# EAGLE design Universaldimmer (EAGLE 5.09)
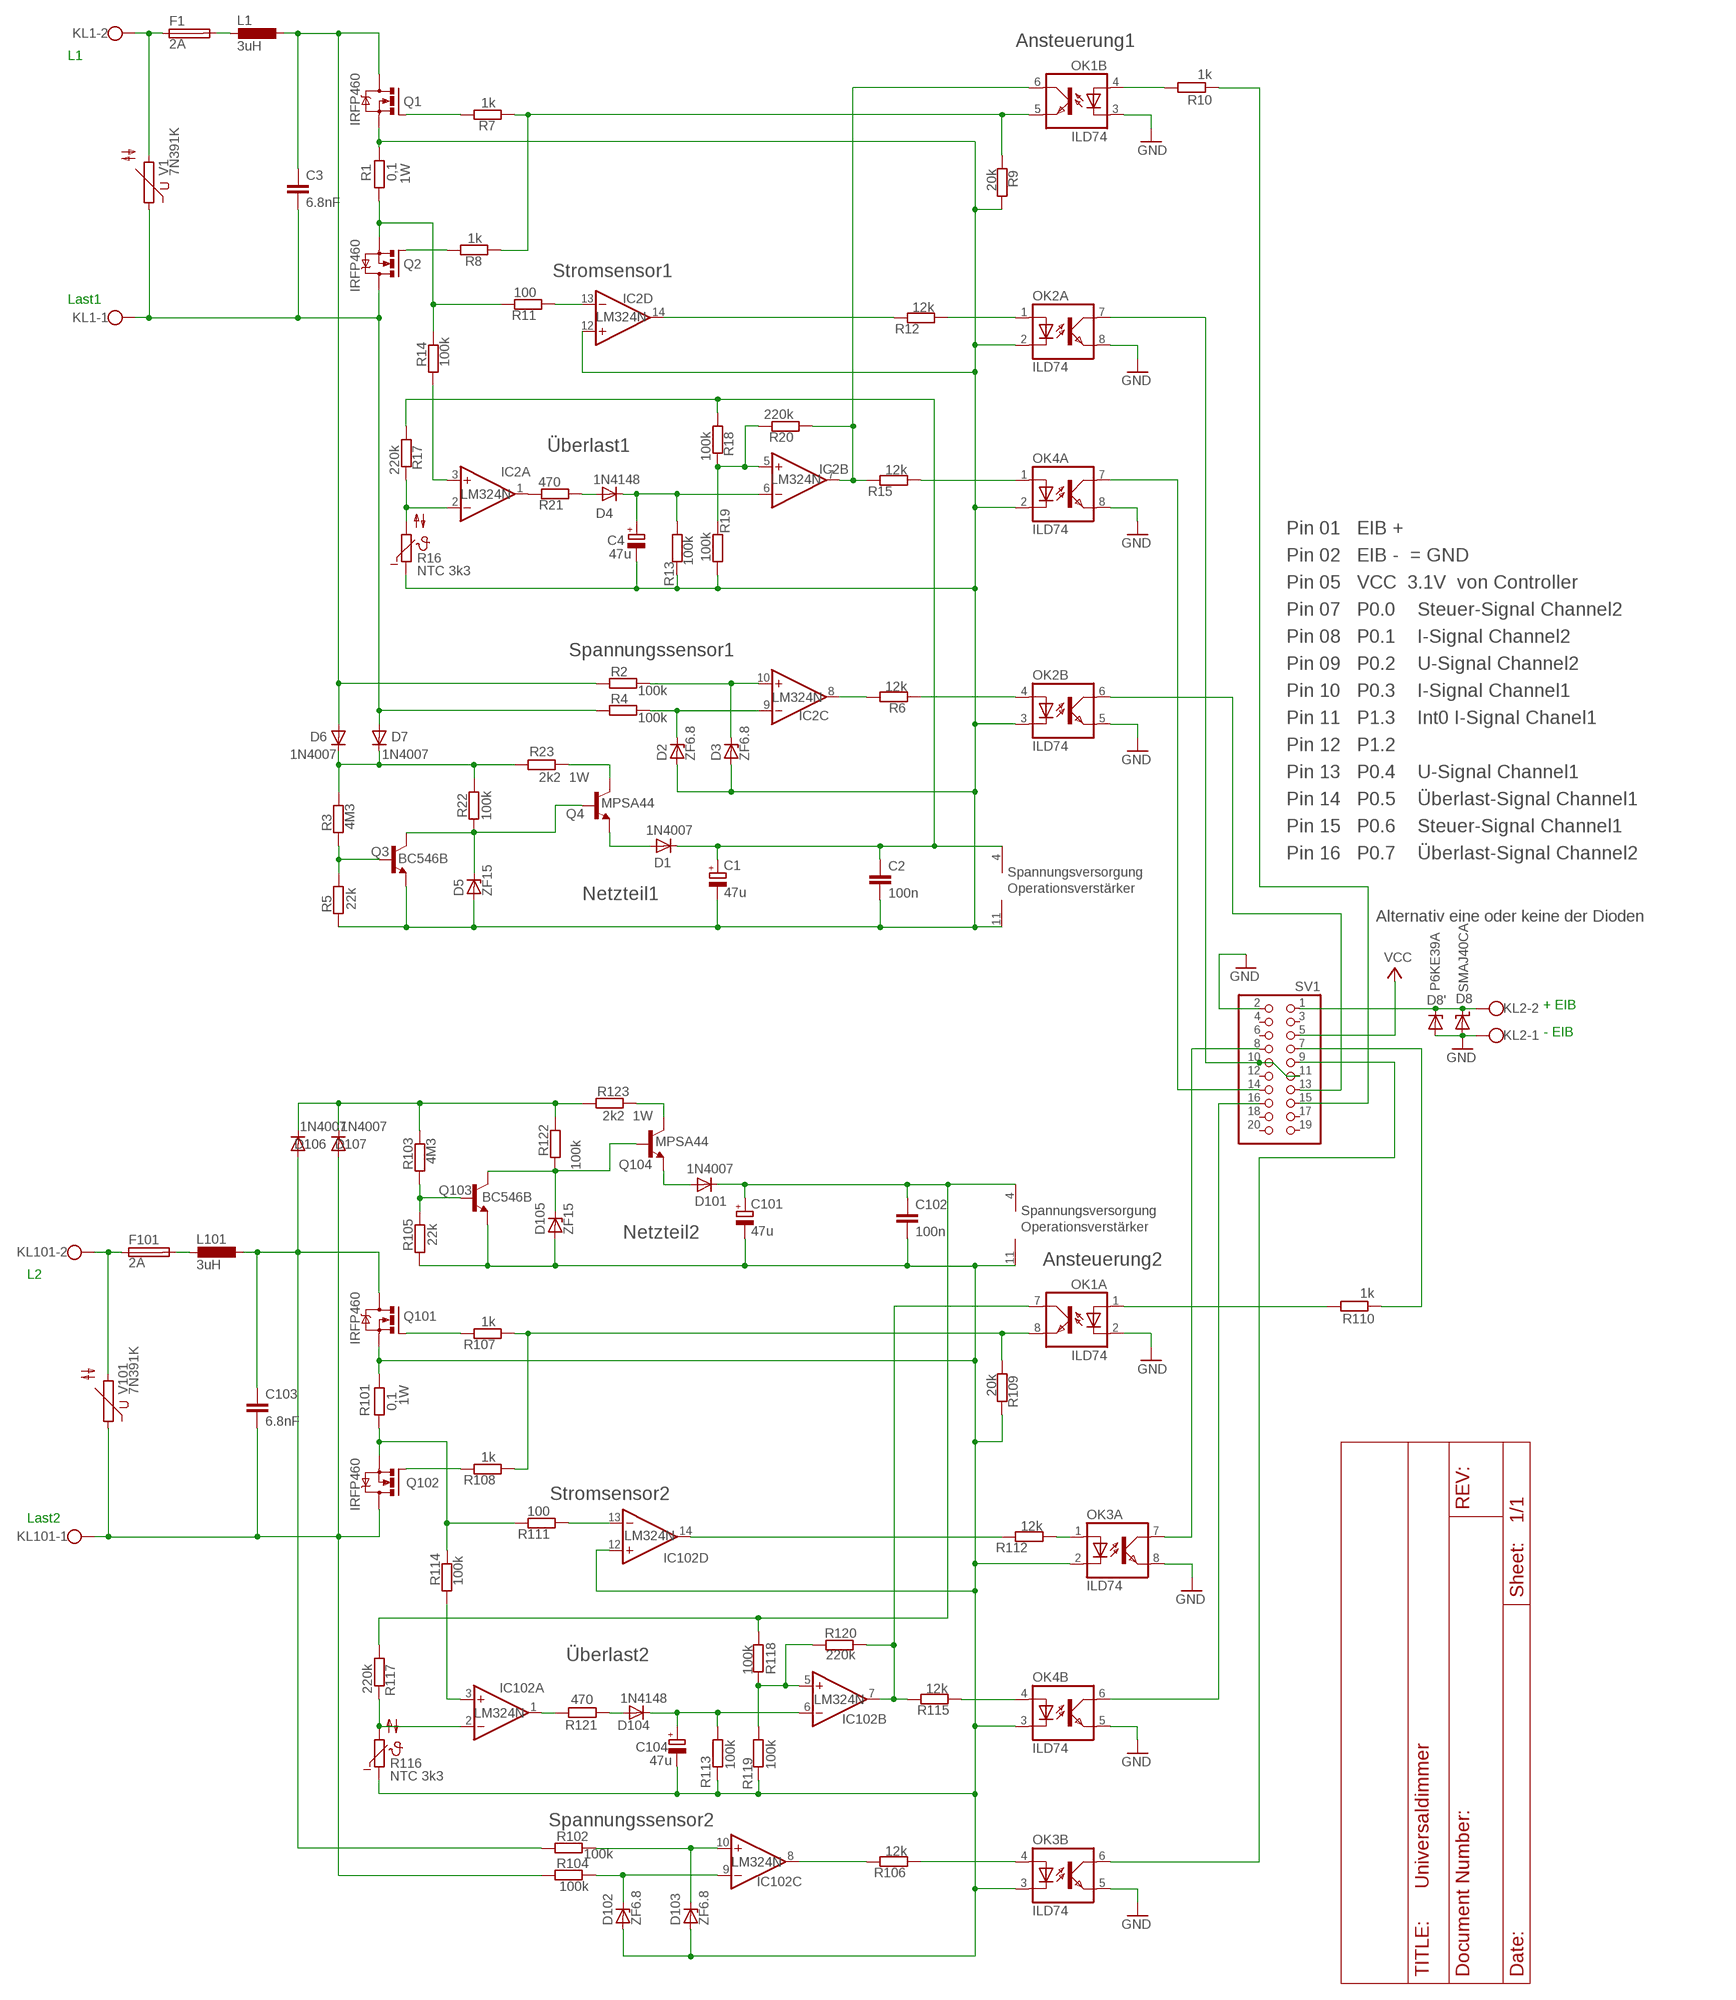
[diagram p0: schematic, sheet 1]

## Parts
C1  47u  CPOL-EUE2-5  [E2-5]
C2  100n  C-EU025-030X050  [C025-030X050]
C3  6.8nF  C-EU050-075X075  [C050-075X075]
C4  47u  CPOL-EUE2-5  [E2-5]
C101  47u  CPOL-EUE2-5  [E2-5]
C102  100n  C-EU025-030X050  [C025-030X050]
C103  6.8nF  C-EU050-075X075  [C050-075X075]
C104  47u  CPOL-EUE2-5  [E2-5]
D1  1N4007  1N4148DO35-7S  [D-7]
D2  ZF6.8  ZENER-DIODEZD-5  [ZDIO-5]
D3  ZF6.8  ZENER-DIODEZD-7.5  [ZDIO-7.5]
D4  1N4148  1N4148DO35-7S  [D-7]
D5  ZF15  ZENER-DIODEZD-7.5  [ZDIO-7.5]
D6  1N4007  DIODE-D-7.5  [D-7.5]
D7  1N4007  DIODE-D-7.5  [D-7.5]
D8  SMAJ40CA  SUPPRESSOR-SMBJ  [SMBJ]
D8'  P6KE39A  ZENER-DIODEZD-7.5  [ZDIO-7.5]
D101  1N4007  1N4148DO35-7S  [D-7]
D102  ZF6.8  ZENER-DIODEZD-5  [ZDIO-5]
D103  ZF6.8  ZENER-DIODEZD-7.5  [ZDIO-7.5]
D104  1N4148  1N4148DO35-7S  [D-7]
D105  ZF15  ZENER-DIODEZD-7.5  [ZDIO-7.5]
D106  1N4007  DIODE-D-7.5  [D-7.5]
D107  1N4007  DIODE-D-7.5  [D-7.5]
F1  2A  TR5  [TR5]
F101  2A  TR5  [TR5]
IC2  LM324N  [DIL14]
IC102  LM324N  [DIL14]
KL1  W237-102  [W237-102]
KL2  W237-102  [W237-102]
KL101  W237-102  [W237-102]
L1  3uH  L-EU414V  [0414V]
L101  3uH  L-EU414V  [0414V]
OK1  ILD74  ILD2  [DIL08]
OK2  ILD74  ILD2  [DIL08]
OK3  ILD74  ILD2  [DIL08]
OK4  ILD74  ILD2  [DIL08]
Q1  IRFP460  IRFPC40  [TO247BV]
Q2  IRFP460  IRFPC40  [TO247BV]
Q3  BC546B  [TO92-EBC]
Q4  MPSA44  MPSA44-NPN-TO92-EBC  [TO92-EBC]
Q101  IRFP460  IRFPC40  [TO247BV]
Q102  IRFP460  IRFPC40  [TO247BV]
Q103  BC546B  [TO92-EBC]
Q104  MPSA44  MPSA44-NPN-TO92-EBC  [TO92-EBC]
R1  0,1  R-EU_0414/5V  [0414V]
R2  100k  R-EU_0204/7  [0204/7]
R3  4M3  R-EU_0204/7  [0204/7]
R4  100k  R-EU_0204/7  [0204/7]
R5  22k  R-EU_0204/7  [0204/7]
R6  12k  R-EU_0204/7  [0204/7]
R7  1k  R-EU_0204/7  [0204/7]
R8  1k  R-EU_0204/7  [0204/7]
R9  20k  R-EU_0204/7  [0204/7]
R10  1k  R-EU_0204/7  [0204/7]
R11  100  R-EU_0204/7  [0204/7]
R12  12k  R-EU_0204/7  [0204/7]
R13  100k  R-EU_0204/7  [0204/7]
R14  100k  R-EU_0204/7  [0204/7]
R15  12k  R-EU_0204/7  [0204/7]
R16  NTC 3k3  NTC640  [P640]
R17  220k  R-EU_0204/7  [0204/7]
R18  100k  R-EU_0204/7  [0204/7]
R19  100k  R-EU_0204/7  [0204/7]
R20  220k  R-EU_0204/7  [0204/7]
R21  470  R-EU_0204/7  [0204/7]
R22  100k  R-EU_0204/7  [0204/7]
R23  2k2 1W  R-EU_0207/15  [0207/15]
R101  0,1  R-EU_0414/5V  [0414V]
R102  100k  R-EU_0204/7  [0204/7]
R103  4M3  R-EU_0204/7  [0204/7]
R104  100k  R-EU_0204/7  [0204/7]
R105  22k  R-EU_0204/7  [0204/7]
R106  12k  R-EU_0204/7  [0204/7]
R107  1k  R-EU_0204/7  [0204/7]
R108  1k  R-EU_0204/7  [0204/7]
R109  20k  R-EU_0204/7  [0204/7]
R110  1k  R-EU_0204/7  [0204/7]
R111  100  R-EU_0204/7  [0204/7]
R112  12k  R-EU_0207/15  [0207/15]
R113  100k  R-EU_0204/7  [0204/7]
R114  100k  R-EU_0204/7  [0204/7]
R115  12k  R-EU_0204/7  [0204/7]
R116  NTC 3k3  NTC640  [P640]
R117  220k  R-EU_0204/7  [0204/7]
R118  100k  R-EU_0204/7  [0204/7]
R119  100k  R-EU_0204/7  [0204/7]
R120  220k  R-EU_0204/7  [0204/7]
R121  470  R-EU_0204/7  [0204/7]
R122  100k  R-EU_0204/7  [0204/7]
R123  2k2 1W  R-EU_0207/15  [0207/15]
SV1  PINHD-2X10  [2X10]
V1  7N391K  S05K11  [S05K11]
V101  7N391K  S05K11  [S05K11]

## Nets
AGND1: C1.- C2.2 C4.- D2.A D3.A D5.A IC2.11(P:V-) IC2.12(D:+IN) OK2.2(A:C) OK2.3(B:C) OK4.2(A:C) Q1.S Q3.E R1.2 R5.1 R9.2 R13.2 R16.1 R19.1
AGND2: C101.- C102.2 C104.- D102.A D103.A D105.A IC102.11(P:V-) IC102.12(D:+IN) OK3.2(A:C) OK3.3(B:C) OK4.3(B:C) Q101.S Q103.E R101.2 R105.1 R109.2 R113.2 R116.1 R119.2
GND: D8'.A D8.A KL2.1 OK1.2(A:C) OK1.3(B:C) OK2.5(B:EMIT) OK2.8(A:EMIT) OK3.5(B:EMIT) OK3.8(A:EMIT) OK4.5(B:EMIT) OK4.8(A:EMIT) SV1.2
N$1: R10.1 SV1.15
N$2: OK1.4(B:A) R10.2
N$3: C3.1 D6.A L1.1 Q1.D R2.1
N$4: Q2.S R1.1 R11.2 R14.2
N$5: OK2.6(B:COL) SV1.13
N$6: IC2.7(B:OUT) OK1.6(B:COL) R15.2 R20.1
N$7: OK2.7(A:COL) SV1.10 SV1.11
N$8: F1.1 KL1.2 V1.2
N$9: Q2.G R8.2
N$10: OK1.1(A:A) R110.2
N$11: IC2.3(A:+IN) R14.1
N$12: D6.C D7.C R3.2 R22.2 R23.1
N$13: OK2.4(B:A) R6.1
N$14: IC102.7(B:OUT) OK1.7(A:COL) R115.2 R120.2
N$15: IC2.8(C:OUT) R6.2
N$16: Q3.B R3.1 R5.2
N$17: Q1.G R7.2
N$18: C3.2 D7.A KL1.1 Q2.D R4.1 V1.1
N$20: D8'.C D8.C KL2.2 SV1.1
N$21: IC2.2(A:-IN) R16.2 R17.2
N$22: F1.2 L1.2
N$23: D3.C IC2.10(C:+IN) R2.2
N$24: D2.C IC2.9(C:-IN) R4.2
N$25: IC2.1(A:OUT) R21.2
N$26: C103.2 D107.A KL101.1 Q102.D R104.1 V101.1
N$27: OK3.1(A:A) R112.1
N$28: OK2.1(A:A) R12.1
N$30: C4.+ D4.C IC2.6(B:-IN) R13.1
N$31: D5.C Q3.C Q4.B R22.1
N$32: OK4.1(A:A) R15.1
N$33: OK4.7(A:COL) SV1.14
N$34: IC2.5(B:+IN) R18.2 R19.2 R20.2
N$35: Q4.C R23.2
N$36: OK1.8(A:EMIT) R107.1 R108.1 R109.1
N$38: Q102.S R101.1 R111.2 R114.2
N$40: Q102.G R108.2
N$42: D106.C D107.C R103.2 R122.2 R123.1
N$43: D103.C IC102.10(C:+IN) R102.2
N$44: D102.C IC102.9(C:-IN) R104.2
N$45: OK3.4(B:A) R106.1
N$46: IC102.8(C:OUT) R106.2
N$47: D1.A Q4.E
N$48: IC2.14(D:OUT) R12.2
N$49: Q103.B R103.1 R105.2
N$50: OK3.6(B:COL) SV1.9
N$51: OK3.7(A:COL) SV1.8
N$52: R110.1 SV1.7
N$53: Q101.G R107.2
N$54: IC102.13(D:-IN) R111.1
N$55: D105.C Q103.C Q104.B R122.1
N$57: IC102.3(A:+IN) R114.1
N$58: IC102.2(A:-IN) R116.2 R117.2
N$59: IC102.1(A:OUT) R121.2
N$60: C104.+ D104.C IC102.6(B:-IN) R113.1
N$61: OK4.4(B:A) R115.1
N$62: OK4.6(B:COL) SV1.16
N$63: Q104.C R123.2
N$64: D4.A R21.1
N$65: D104.A R121.1
N$66: IC102.5(B:+IN) R118.2 R119.1 R120.1
N$68: D101.A Q104.E
N$69: OK1.5(B:EMIT) R7.1 R8.1 R9.1
N$71: F101.1 KL101.2 V101.2
N$72: IC102.14(D:OUT) R112.2
N$73: F101.2 L101.2
N$74: IC2.13(D:-IN) R11.1
N$75: C103.1 D106.A L101.1 Q101.D R102.1
V12-C1: C1.+ C2.1 D1.C IC2.4(P:V+) R17.1 R18.1
V12-C2: C101.+ C102.1 D101.C IC102.4(P:V+) R117.1 R118.1
VCC: SV1.5
Unconnected: SV1.3 SV1.4 SV1.6 SV1.12 SV1.17 SV1.18 SV1.19 SV1.20

## Notes on the sheet
- Ansteuerung1
- L1
- 1W
- Stromsensor1
- Last1
- Überlast1
- Pin 01   EIB +
- Pin 02   EIB -  = GND
- Pin 05   VCC  3.1V  von Controller
- Pin 07   P0.0    Steuer-Signal Channel2
- Pin 08   P0.1    I-Signal Channel2
- Spannungssensor1
- Pin 09   P0.2    U-Signal Channel2
- Pin 10   P0.3    I-Signal Channel1
- Pin 11   P1.3    Int0 I-Signal Chanel1
- Pin 12   P1.2
- Pin 13   P0.4    U-Signal Channel1
- Pin 14   P0.5    Überlast-Signal Channel1
- Pin 15   P0.6    Steuer-Signal Channel1
- Pin 16   P0.7    Überlast-Signal Channel2
- Spannungsversorgung
- Operationsverstärker
- Netzteil1
- Alternativ eine oder keine der Dioden
- + EIB
- - EIB
- Spannungsversorgung
- Operationsverstärker
- Netzteil2
- Ansteuerung2
- L2
- 1W
- Stromsensor2
- Last2
- Überlast2
- Spannungssensor2

## Library data of the parts
C1 C4 C101 C104 = rcl:CPOL-EU: POLARIZED CAPACITOR, European symbol
C2 C3 C102 C103 = rcl:C-EU: CAPACITOR, European symbol
D1 D4 D101 D104 = diode:1N4148: DIODE high speed (Philips)
D2 D3 D5 D8' D102 D103 D105 = diode:ZENER-DIODE: Z-Diode
D6 D7 D106 D107 = diode:DIODE-: DIODE
D8 = diode:SUPPRESSOR-: Suppressor diode
F1 F101 = fuse:TR5: FUSE Wickmann
IC2 IC102 = linear:LM324: OP AMP
KL1 KL2 KL101 = con-wago-500:W237-102: WAGO SCREW CLAMP
L1 L101 = rcl:L-EU: INDUCTOR, European symbol
OK1-OK4 = optocoupler:ILD2: SIEMENS OPTO COUPLER
Q1 Q2 Q101 Q102 = transistor-power:IRFPC40: N-CHANNEL MOS FET
Q3 Q103 = transistor-npn:BC546*: NPN Transistor
Q4 Q104 = transistor:*-NPN-: NPN Transistror BF959 corrected 2008.03.06
R1-R15 R17-R23 R101-R115 R117-R123 = rcl:R-EU_: RESISTOR, European symbol
R16 R116 = ptc-ntc:NTC640: PHILIPS NTC
SV1 = pinhead:PINHD-2X10: PIN HEADER
V1 V101 = varistor:S05K11: VARISTOR

## Board
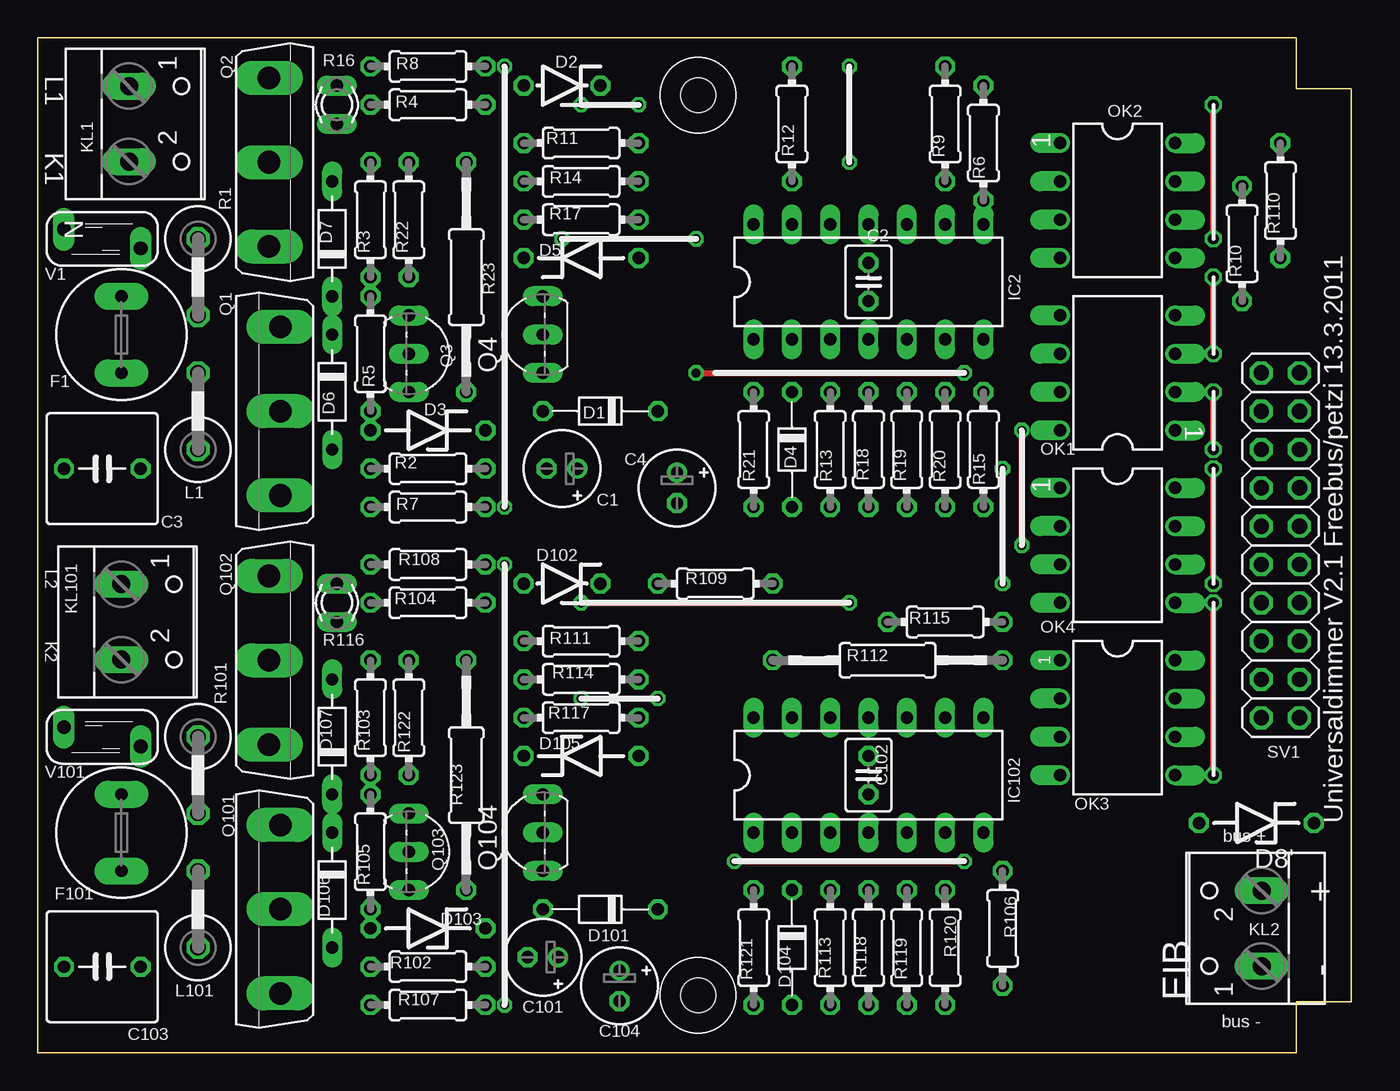
[diagram p1: board, top side]
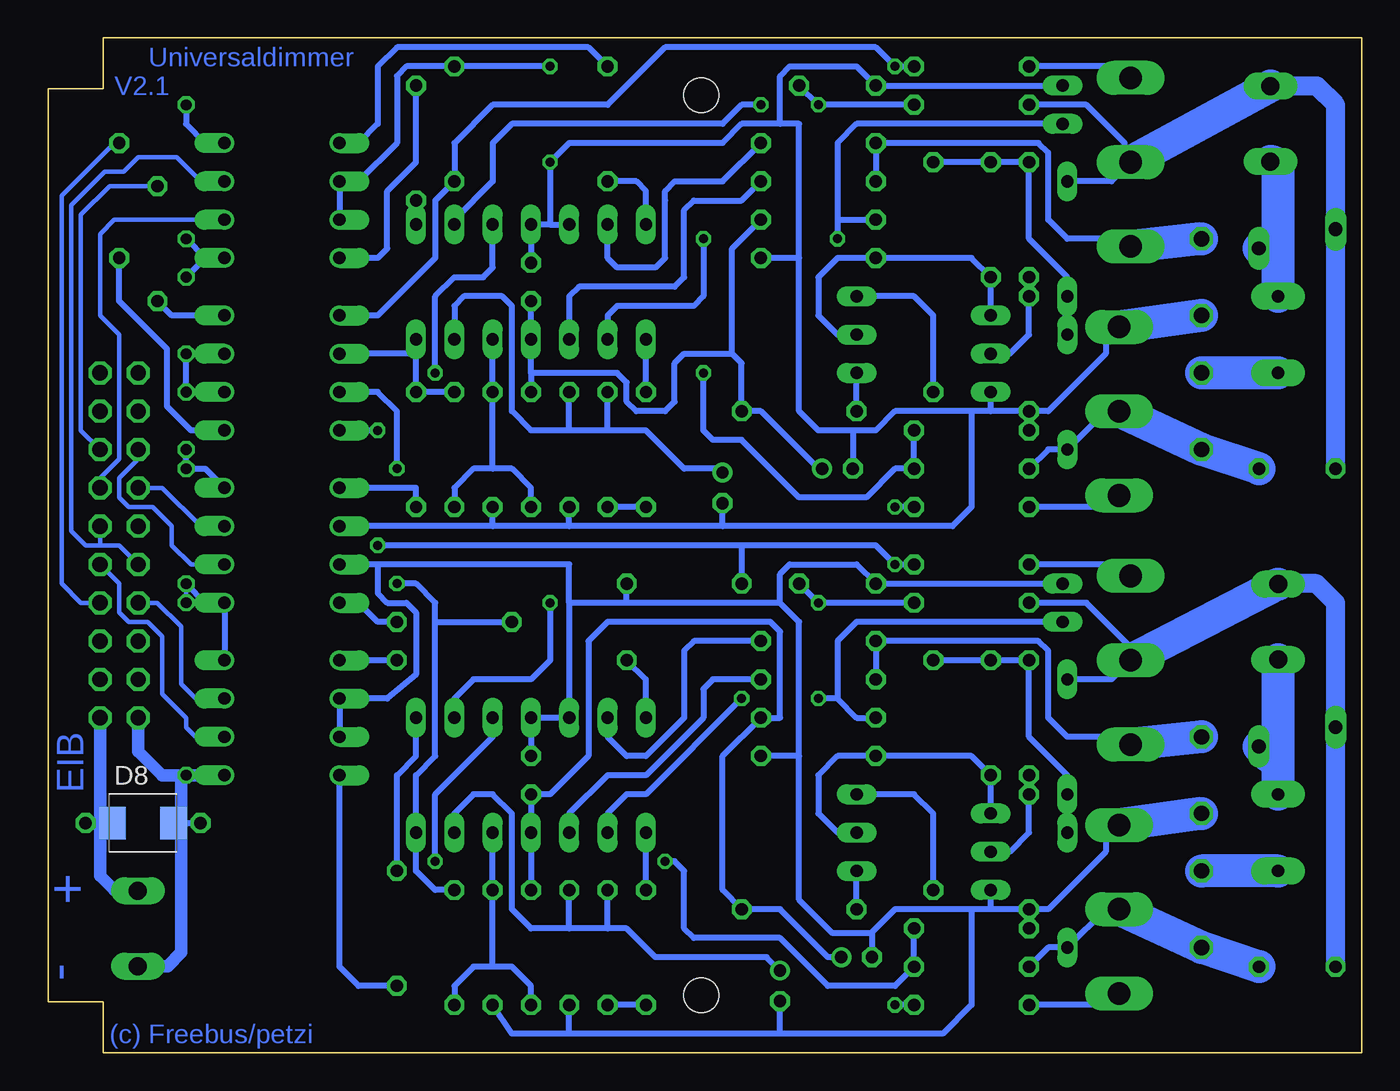
[diagram p2: board, bottom side, seen from below]

Size 87.1 x 67.31 mm. Coordinates in mm from the lower left corner, seen from the top.
Outline: 0,0.01 83.45,0 83.45,3.38 87.1,3.38 87.1,63.93 83.45,63.93 83.45,67.31 0,67.31 0,0.01
Copper layers (1*16): Top 0.035mm / dielectric 1.5mm / Bottom 0.035mm
Design rules "default *": minimum track width 10mil, minimum drill 24mil, track to track 12mil, track to pad 12mil, pad to pad 16mil, via to via 16mil, smd to smd 8mil, copper to edge 10mil, drill to drill 10mil, minimum pad ring 10mil, minimum via ring 8mil, stop-mask expansion 4mil, vias tented up to drill 0mil, thermal gap 10mil
Holes 2.3 mm at 43.79,3.81 43.79,63.5

### Footprints (pad centres in the part's own frame; a part is rotated, then mirrored left to right if it is on the bottom)
E2-5 = drill 0.813 pad 1.27 round: + -1.016,0 | drill 0.813 pad 1.27 octagon: - 1.016,0
C025-030X050 = drill 0.813 octagon: 1 -1.27,0; 2 1.27,0
C050-075X075 = drill 0.813 octagon: 1 -2.54,0; 2 2.54,0
D-7 = drill 0.813 octagon: A 3.81,0; C -3.81,0
ZDIO-5 = drill 0.813 octagon: A 2.54,0; C -2.54,0
ZDIO-7.5 = drill 0.813 octagon: A 3.81,0; C -3.81,0
D-7.5 = drill 0.813 long: A 3.81,0; C -3.81,0
SMBJ = smd 1.78 x 2.16: A 2.04,0; C -2.03,0
TR5 = drill 0.813 pad 1.778 long: 1 -2.54,0; 2 2.54,0
DIL14 = drill 0.813 long: 1 -7.62,-3.81; 2 -5.08,-3.81; 3 -2.54,-3.81; 4 0,-3.81; 5 2.54,-3.81; 6 5.08,-3.81; 7 7.62,-3.81; 8 7.62,3.81; 9 5.08,3.81; 10 2.54,3.81; 11 0,3.81; 12 -2.54,3.81; 13 -5.08,3.81; 14 -7.62,3.81
W237-102 = drill 1.194 long: 1 -2.5,-1.27; 2 2.5,-1.27
0414V = drill 1.016 octagon: 1 -2.54,0; 2 2.54,0
DIL08 = drill 0.813 offset: 1 -3.81,-3.81; 2 -1.27,-3.81; 3 1.27,-3.81; 4 3.81,-3.81; 5 3.81,3.81; 6 1.27,3.81; 7 -1.27,3.81; 8 -3.81,3.81
TO247BV = drill 1.499 long: D 0,-2.921; G -5.588,-2.921; S 5.588,-2.921
TO92-EBC = drill 0.813 long: B 0,-1.27; C -2.54,-1.27; E 2.54,-1.27
TO92-EBC' = drill 0.813 long: B 0,-1.27; C 2.54,-1.27; E -2.54,-1.27
0204/7 = drill 0.813 octagon: 1 -3.81,0; 2 3.81,0
P640 = drill 0.813 long: 1 -1.27,0; 2 1.27,0
0207/15 = drill 0.813 octagon: 1 -7.62,0; 2 7.62,0
2X10 = drill 1.016 octagon: 1 -11.43,-1.27; 2 -11.43,1.27; 3 -8.89,-1.27; 4 -8.89,1.27; 5 -6.35,-1.27; 6 -6.35,1.27; 7 -3.81,-1.27; 8 -3.81,1.27; 9 -1.27,-1.27; 10 -1.27,1.27; 11 1.27,-1.27; 12 1.27,1.27; 13 3.81,-1.27; 14 3.81,1.27; 15 6.35,-1.27; 16 6.35,1.27; 17 8.89,-1.27; 18 8.89,1.27; 19 11.43,-1.27; 20 11.43,1.27
S05K11 = drill 0.914 long: 1 -0.635,-2.54; 2 0.635,2.54

### Placement (x,y rotation side)
C1  34.76,38.73 180 top
C2  55.08,51.12 90 top
C3  4.28,38.73 180 top
C4  42.38,37.46 270 top
C101  33.49,6.35 180 top
C102  55.08,18.42 90 top
C103  4.28,5.71 180 top
C104  38.57,4.45 270 top
D1  37.3,42.54 180 top
D2  34.76,64.14 180 top
D3  25.87,41.27 180 top
D4  50,40 270 top
D5  36.03,52.7 0 top
D6  19.52,43.81 270 top
D7  19.52,53.98 90 top
D8  80.8,15.24 0 bottom
D8'  80.8,15.24 180 top
D101  37.3,9.53 180 top
D102  34.76,31.12 180 top
D103  25.87,8.26 180 top
D104  50,6.98 270 top
D105  36.03,19.69 0 top
D106  19.52,10.79 270 top
D107  19.52,20.96 90 top
F1  5.55,47.62 270 top
F101  5.55,14.61 270 top
IC2  55.08,51.12 0 top
IC102  55.08,18.42 0 top
KL1  7.32,61.59 270 top
KL2  79.88,8.26 90 top
KL101  6.82,28.58 270 top
L1  10.63,42.54 90 top
L101  10.63,9.53 90 top
OK1  71.59,45.09 90 top
OK2  71.59,56.52 270 top
OK3  71.59,22.23 270 top
OK4  71.59,33.66 270 top
Q1  13.17,42.54 90 top
Q2  18.25,59.05 270 top
Q3  25.87,46.35 270 top
Q4  MPSA44  [TO92-EBC']  32.22,47.62 90 top
Q101  13.17,9.53 90 top
Q102  18.25,26.04 270 top
Q103  25.87,13.33 270 top
Q104  MPSA44  [TO92-EBC']  32.22,14.61 90 top
R1  10.63,51.43 270 top
R2  25.87,38.73 0 top
R3  22.06,55.24 90 top
R4  25.87,62.86 0 top
R5  22.06,46.35 90 top
R6  62.7,60.32 270 top
R7  25.87,36.2 180 top
R8  25.87,65.41 180 top
R9  60.16,61.59 90 top
R10  79.84,53.66 270 top
R11  36.03,60.32 180 top
R12  50,61.59 270 top
R13  52.54,40 270 top
R14  36.03,57.78 180 top
R15  62.7,40 90 top
R16  19.84,62.86 270 top
R17  36.03,55.24 180 top
R18  55.08,40 270 top
R19  57.62,40 90 top
R20  60.16,40 270 top
R21  47.46,40 90 top
R22  24.6,55.24 90 top
R23  28.41,51.43 270 top
R101  10.63,18.42 270 top
R102  25.87,5.71 0 top
R103  22.06,22.23 90 top
R104  25.87,29.85 0 top
R105  22.06,13.33 90 top
R106  63.97,8.26 90 top
R107  25.87,3.17 180 top
R108  25.87,32.38 180 top
R109  44.92,31.12 0 top
R110  82.38,56.52 270 top
R111  36.03,27.31 180 top
R112  56.35,26.04 180 top
R113  52.54,6.98 270 top
R114  36.03,24.77 180 top
R115  60.16,28.58 180 top
R116  19.84,29.85 270 top
R117  36.03,22.23 180 top
R118  55.08,6.98 270 top
R119  57.62,6.98 270 top
R120  60.16,6.98 90 top
R121  47.46,6.98 90 top
R122  24.6,22.23 90 top
R123  28.41,18.42 270 top
SV1  82.38,33.66 90 top
V1  4.28,53.98 270 top
V101  4.28,20.96 270 top

### Tracks (layer width: path | path; a pad name or v marks a point on that pad's centre or on a via)
AGND1  (via drill 0.6)
  Top 0.406: v53.81,59.05 v53.81,65.41
  Bottom 0.406: Q1.S 16.98,47.24 16.98,46.35 20.79,42.54 R5.1 | R5.1 D3.A | R5.1 24.6,42.54 | 24.6,42.54 25.87,42.54 | 24.6,42.54 Q3.E | 52.54,34.92 57.62,34.92 | 57.62,34.92 OK4.2 | 52.54,34.92 R13.2 | 57.62,34.92 R19.1 | 25.87,42.54 25.87,36.2 27.14,34.92 42.38,34.92 | 42.38,34.92 52.54,34.92 | 42.38,34.92 C4.- | OK2.3 OK2.2 66.51,57.78 63.97,60.32 63.97,64.77 63.34,65.41 R9.2 v53.81,65.41 | 37.3,52.7 37.3,42.54 36.03,41.27 33.74,41.27 | 37.3,52.7 37.3,61.59 38.57,61.59 | 53.81,54.93 IC2.12 | 53.81,54.93 IC2.11 C2.2 | R16.1 D2.A 33.49,65.41 37.94,65.41 38.57,64.77 38.57,61.59 | 53.81,54.93 v53.81,59.05 52.54,60.32 42.38,60.32 41.11,61.59 38.57,61.59 | 37.3,52.7 D5.A | 25.87,42.54 30.95,42.54 32.22,41.27 33.49,41.27 33.74,41.27 | 33.74,41.27 C1.-
  Bottom 2.184: R1.2 Q1.S
AGND2
  Bottom 0.406: Q101.S 16.98,14.22 16.98,13.33 20.79,9.53 R105.1 | R105.1 D103.A | R105.1 24.6,9.53 | 24.6,9.53 Q103.E | R116.1 D102.A 33.49,32.38 37.94,32.38 38.57,31.75 38.57,29.85 | 24.6,9.53 25.87,9.53 | 25.87,9.53 30.95,9.53 32.47,8 32.47,7.94 | 32.47,7.94 C101.- | 32.47,7.94 35.08,7.94 37.3,10.16 37.3,19.69 | 37.3,19.69 37.3,28.58 38.57,29.85 | 25.87,9.53 25.87,3.17 27.77,1.27 38.57,1.27 | R119.2 56.35,1.27 52.54,1.27 | 52.54,1.27 R113.2 | OK3.3 OK3.2 64.61,23.5 62.7,25.08 62.7,29.21 63.34,29.85 64.61,29.85 65.24,30.48 65.24,32.38 | 65.24,32.38 OK4.3 | 38.57,29.85 48.73,29.85 | 48.73,29.85 R109.2 | 38.57,1.27 52.54,1.27 | 38.57,1.27 C104.- | 65.24,32.38 52.54,32.38 52.54,29.85 | 52.54,29.85 IC102.12 IC102.11 C102.2 | 48.73,29.85 52.54,29.85 | 37.3,19.69 D105.A
  Bottom 2.184: R101.2 Q101.S
GND  (via drill 0.7)
  Top 0.406: v77.94,53.98 v77.94,62.86 | v77.94,46.35 v77.94,51.43 | v77.94,40 v77.94,43.81 | v77.94,31.12 v77.94,38.73 | v77.94,18.42 v77.94,29.85
  Bottom 0.305: v77.94,29.85 v77.94,31.12
  Bottom 0.406: OK2.8 76.67,60.32 77.94,61.59 v77.94,62.86 | 76.67,52.7 OK2.5 | 76.67,52.7 v77.94,53.98 | v77.94,51.43 76.67,52.7 | OK1.3 v77.94,46.35 v77.94,43.81 OK1.2 | OK4.8 76.67,38.73 v77.94,38.73 v77.94,40 | v77.94,31.12 76.67,29.85 OK4.5 | OK4.5 OK3.8 | v77.94,29.85 OK4.5 | D8.A 78.26,15.24 D8'.A
  Bottom 0.813: v77.94,18.42 OK3.5 | v77.94,18.42 79.53,18.42 81.11,20 SV1.2 | KL2.1 79.17,5.75 78.26,6.67 78.26,15.24 78.26,15.88 78.26,18.1 v77.94,18.42
N$1
  Bottom 0.305: SV1.15 84.92,41.27 84.92,55.56 83.02,57.47 R10.1
N$2
  Bottom 0.406: 76.67,48.89 OK1.4 78.89,48.89 R10.2
N$3
  Bottom 0.406: R2.1 20.79,40 D6.A 16.98,42.54 Q1.D
  Bottom 2.184: Q1.D L1.1 C3.1
N$4
  Bottom 0.406: Q2.S 15.84,53.98 19.52,53.98 20.79,55.24 20.79,59.69 21.42,60.32 R11.2 R14.2
  Bottom 2.184: R1.1 Q2.S
N$5
  Bottom 0.305: SV1.13 83.66,38.1 82.38,39.37 82.38,47.62 83.66,48.89 83.66,54.29 82.7,55.24 OK2.6
N$6
  Bottom 0.406: 62.7,46.35 R15.2 R20.1 | 62.7,46.35 IC2.7 | 62.7,46.35 OK1.6
N$7
  Bottom 0.305: SV1.10 82.38,33.66 83.66,33.66 | OK2.7 76.99,57.78 78.57,59.37 81.11,59.37 82.07,58.42 83.34,58.42 85.56,56.2 85.56,34.61 84.61,33.66 83.66,33.66 | 83.66,33.66 SV1.11
N$8
  Bottom 2.184: F1.1 5.55,53.98 | 5.55,53.98 5.55,58.59 arc-90 KL1.2 | V1.2 6.19,53.34 arc-90 5.55,53.98
N$9
  Bottom 0.406: R8.2 16.09,65.41 Q2.G
N$10
  Bottom 0.406: OK1.1 77.62,41.27 79.21,42.86 79.21,46.67 82.38,49.85 R110.2
N$11
  Bottom 0.406: R14.1 41.11,56.52 44.29,56.52 44.92,55.88 44.92,51.43 45.55,50.8 51.91,50.8 52.54,50.16 IC2.3
N$12
  Bottom 0.406: R3.2 R23.1 | R3.2 R22.2 | R3.2 22.06,53.98 19.52,51.43 D7.C
  Bottom 0.61: D6.C D7.C
N$13
  Bottom 0.406: R6.1 62.7,59.05 64.61,57.15 64.61,53.34 65.24,52.7 OK2.4
N$14  (via drill 0.6)
  Top 0.406: v63.97,31.12 v63.97,38.73
  Bottom 0.406: OK1.7 65.24,43.81 63.97,42.54 v63.97,38.73 | R120.2 61.43,10.79 62.7,12.06 IC102.7 62.7,18.42 61.43,19.69 61.43,28.58 | 61.43,28.58 61.43,29.85 62.7,31.12 v63.97,31.12 | 61.43,28.58 R115.2
N$15
  Bottom 0.406: IC2.8 R6.2
N$16
  Bottom 0.406: R3.1 R5.2 22.06,47.62 23.33,46.35 Q3.B
N$17
  Bottom 0.406: Q1.G 16.85,36.2 R7.2
N$18
  Bottom 0.406: D7.A 16.6,57.78 Q2.D 15.71,59.44 15.71,60.32 18.25,62.86 R4.1
  Bottom 1.27: C3.2 V1.1 1.74,62.86 2.97,64.09 KL1.1
  Bottom 2.184: KL1.1 Q2.D
N$20
  Bottom 0.406: 83.66,15.24 D8.C 82.83,14.61 83.02,14.61 83.02,15.24 D8'.C
  Bottom 0.813: SV1.1 83.66,15.24 83.66,11.75 82.7,10.79 81.19,10.79 KL2.2
N$21  (via drill 0.6)
  Top 0.406: v34.76,53.98 v43.65,53.98
  Bottom 0.406: 34.76,55.24 R17.2 | 34.76,55.24 34.76,60.32 33.49,61.59 R16.2 | 34.76,55.24 v34.76,53.98 | v43.65,53.98 43.65,50.16 44.29,49.53 49.37,49.53 50,48.89 IC2.2
N$22
  Bottom 2.184: F1.2 L1.2
N$23  (via drill 0.6)
  Top 0.406: v43.65,45.09 v61.43,45.09
  Bottom 0.406: D3.C R2.2 30.95,38.73 32.85,36.83 37.3,36.83 41.11,40.64 43.02,40.64 43.65,41.27 v43.65,45.09 | IC2.10 57.62,52.07 58.26,51.43 60.16,51.43 61.43,50.16 v61.43,45.09
N$24  (via drill 0.6)
  Top 0.406: v36.03,62.86 v39.84,62.86
  Bottom 0.406: v39.84,62.86 41.11,62.86 42.38,61.59 56.35,61.59 57.62,60.32 57.62,57.78 60.16,55.24 IC2.9 | R4.2 v36.03,62.86 D2.C
N$25
  Bottom 0.406: R21.2 IC2.1
N$26
  Bottom 0.406: R104.1 18.25,29.85 15.33,26.92 Q102.D 16.6,24.77 D107.A
  Bottom 1.27: KL101.1 5.51,31.12 3.01,31.12 1.74,29.85 V101.1 C103.2
  Bottom 2.184: KL101.1 Q102.D
N$27
  Bottom 0.406: R112.1 OK3.1
N$28
  Bottom 0.406: OK2.1 66.51,60.32 65.24,61.59 65.24,65.41 63.97,66.68 51.27,66.68 R12.1
N$30
  Bottom 0.406: 60.16,47.62 IC2.6 60.16,49.53 59.52,50.16 56.98,50.16 56.35,49.53 56.35,42.54 55.08,41.27 52.54,41.27 | 50,41.27 47.46,41.27 44.92,38.73 42.63,38.73 C4.+ | 50,41.27 52.54,41.27 | 52.54,41.27 R13.1 | 50,41.27 D4.C
N$31
  Bottom 0.406: Q3.C R22.1 25.87,52.7 D5.C 34.76,52.7 36.03,51.43 36.03,48.89 34.76,47.62 Q4.B
N$32
  Bottom 0.406: OK4.1 62.7,37.46 R15.1
N$33
  Bottom 0.305: SV1.14 79.53,37.46 76.99,34.92 OK4.7
N$34
  Bottom 0.406: IC2.5 R19.2 57.62,38.73 | R18.2 55.08,37.46 56.35,38.73 57.62,38.73 | 57.62,38.73 58.89,38.73 60.16,37.46 R20.2
N$35
  Bottom 0.406: Q4.C 29.68,50.16 28.41,48.89 R23.2
N$36  (via drill 0.6)
  Top 0.406: v30.95,3.17 v30.95,32.38 | v65.24,33.66 v65.24,41.27
  Bottom 0.406: R107.1 v30.95,3.17 | R108.1 v30.95,32.38 32.22,33.66 41.11,33.66 | 41.11,33.66 v65.24,33.66 | 41.11,33.66 R109.1 | v65.24,41.27 OK1.8 v65.24,41.27
N$37  (via drill 0.6)
  other vias: 30.95,3.17
N$38
  Bottom 0.406: Q102.S 15.84,20.96 19.52,20.96 20.79,22.23 20.79,26.67 21.42,27.31 R111.2 R114.2
  Bottom 2.184: R101.1 Q102.S
N$39  (via drill 0.6)
  other vias: 30.95,32.38
N$40
  Bottom 0.406: Q102.G 16.09,32.38 R108.2
N$41  (via drill 0.6)
  other vias: 43.79,63.5
N$42
  Bottom 0.406: R123.1 R122.2 R103.2 22.06,20.96 19.52,18.42 D107.C D106.C
N$43  (via drill 0.6)
  Top 0.406: v46.19,12.7 v61.43,12.7
  Bottom 0.406: D103.C R102.2 30.95,4.45 35.4,4.45 38.57,7.62 44.29,7.62 44.92,8.26 44.92,12.06 45.55,12.7 v46.19,12.7 | IC102.10 57.62,20.96 61.43,17.15 v61.43,12.7
N$44  (via drill 0.6)
  Top 0.406: v36.03,29.85 v53.81,29.85
  Bottom 0.406: R104.2 v36.03,29.85 D102.C | IC102.9 60.16,23.5 58.89,24.77 55.08,24.77 53.81,26.04 v53.81,29.85
N$45
  Bottom 0.406: OK3.4 67.78,5.71 66.51,4.45 R106.1
N$46
  Bottom 0.406: R106.2 63.97,18.42 62.7,19.69 IC102.8
N$47
  Bottom 0.406: D1.A Q4.E
N$48
  Bottom 0.406: R12.2 48.09,57.78 47.46,57.15 IC2.14
N$49
  Bottom 0.406: R103.1 R105.2 22.06,14.61 23.33,13.33 Q103.B
N$50
  Bottom 0.305: SV1.9 82.38,31.12 82.38,29.21 81.75,28.58 80.48,28.58 79.53,27.62 79.53,23.81 77.94,22.23 77.94,21.59 77.3,20.96 76.67,20.96
  Bottom 0.406: OK3.6 76.67,20.96
N$51
  Bottom 0.305: SV1.8 79.84,29.85 78.26,28.26 78.26,24.45 77.3,23.5 OK3.7
  Bottom 0.406: OK3.7 76.67,23.5
N$52
  Bottom 0.305: SV1.7 84.92,29.85 86.19,31.12 86.19,56.83 83.02,60.01 82.7,60.01 R110.1
N$53
  Bottom 0.406: R107.2 16.98,3.17 16.22,3.94 Q101.G
N$54
  Bottom 0.406: IC102.13 50,20.96 48.73,19.69 47.46,19.69 44.92,22.23 44.92,26.67 44.29,27.31 R111.1
N$55
  Bottom 0.406: Q103.C R122.1 25.87,19.69 D105.C 34.76,19.69 36.03,18.42 36.03,15.88 34.76,14.61 Q104.B
N$57
  Bottom 0.406: IC102.3 52.54,15.88 50,18.42 47.46,18.42 43.65,22.23 43.65,24.13 43.02,24.77 R114.1
N$58  (via drill 0.6)
  Top 0.406: v36.03,23.5 v41.11,23.5
  Bottom 0.406: R116.2 33.49,28.58 34.76,27.31 34.76,23.5 | 34.76,23.5 33.49,22.23 R117.2 | 34.76,23.5 v36.03,23.5 | IC102.2 50,15.88 48.73,17.15 47.46,17.15 v41.11,23.5
N$59
  Bottom 0.406: R121.2 IC102.1
N$60
  Bottom 0.406: C104.+ 39.46,6.35 46.83,6.35 48.73,8.26 50,8.26 | 50,8.26 52.54,8.26 | 52.54,8.26 55.08,8.26 56.35,9.53 56.35,15.88 57.62,17.15 58.89,17.15 60.16,15.88 IC102.6 | 52.54,8.26 R113.1 | 50,8.26 D104.C
N$61
  Bottom 0.406: R115.1 65.24,28.58 66.51,29.85 OK4.4
N$62
  Bottom 0.305: SV1.16 81.11,39.37 82.38,38.1 82.38,36.83 81.75,36.2 80.16,36.2 78.89,34.92 78.89,33.66 77.62,32.38 OK4.6
N$63
  Bottom 0.406: Q104.C 29.68,17.15 28.41,15.88 R123.2
N$64
  Bottom 0.406: R21.1 D4.A
N$65
  Bottom 0.406: R121.1 D104.A
N$66
  Bottom 0.406: R120.1 60.16,4.45 58.89,5.71 57.62,5.71 | 57.62,5.71 56.35,5.71 55.08,4.45 R118.2 | 57.62,5.71 R119.1 IC102.5
N$67  (via drill 0.6)
  other vias: 43.79,3.81
N$68
  Bottom 0.406: D101.A Q104.E
N$69  (via drill 0.6)
  Top 0.406: v30.95,36.2 v30.95,65.41
  Bottom 0.406: R8.1 v30.95,65.41 32.22,66.68 46.19,66.68 50,62.86 57.62,62.86 60.16,60.32 R9.1 61.43,56.52 61.43,52.7 65.24,48.89 OK1.5 | R7.1 v30.95,36.2
N$71
  Bottom 2.184: F101.1 5.55,19.69 | 5.55,19.69 KL101.2 | V101.2 6.19,19.69 5.55,19.69
N$72
  Bottom 0.406: IC102.14 47.46,24.77 R112.2
N$73
  Bottom 2.184: F101.2 L101.2
N$74
  Bottom 0.406: R11.1 42.38,57.78 45.55,57.78 46.19,57.15 46.19,56.52 46.19,52.7 46.83,52.07 49.37,52.07 50,52.7 IC2.13
N$75
  Bottom 0.406: R102.1 20.79,6.98 D106.A 16.98,9.53 Q101.D
  Bottom 2.184: Q101.D L101.1 C103.1
V12-C1
  Bottom 0.406: 55.08,45.09 IC2.4 C2.1 | C1.+ 36.03,38.73 39.84,42.54 D1.C 41.11,45.72 41.75,46.35 | 41.75,46.35 44.92,46.35 45.55,45.72 45.55,43.18 46.19,42.54 48.09,42.54 48.73,43.18 48.73,44.45 49.37,45.09 55.08,45.09 | R17.1 41.75,53.34 41.75,46.35 | 55.08,45.09 R18.1
V12-C2
  Bottom 0.406: IC102.4 R118.1 | IC102.4 55.08,15.88 | C101.+ 35.4,6.35 38.57,9.53 D101.C 42.38,10.79 42.38,19.69 R117.1 38.57,22.23 38.57,27.94 39.21,28.58 50,28.58 51.27,27.31 51.27,19.69 53.81,17.15 C102.1 IC102.4

### Text on the board
Bottom: Universaldimmer | V2.1 | EIB | + | - | (c) Freebus/petzi
tPlace: L1 | K1 | 1 | N | 1 | 1 | L2 | K2 | 1 | Universaldimmer V2.1 Freebus/petzi 13.3.2011 | bus + | + | - | EIB | bus -